# Altium schematic sheet LEDs_Switches.SchDoc: LEDs AND SWITCHES
size A4; DocumentNumber: 12; SheetNumber: 12; SheetTotal: 18
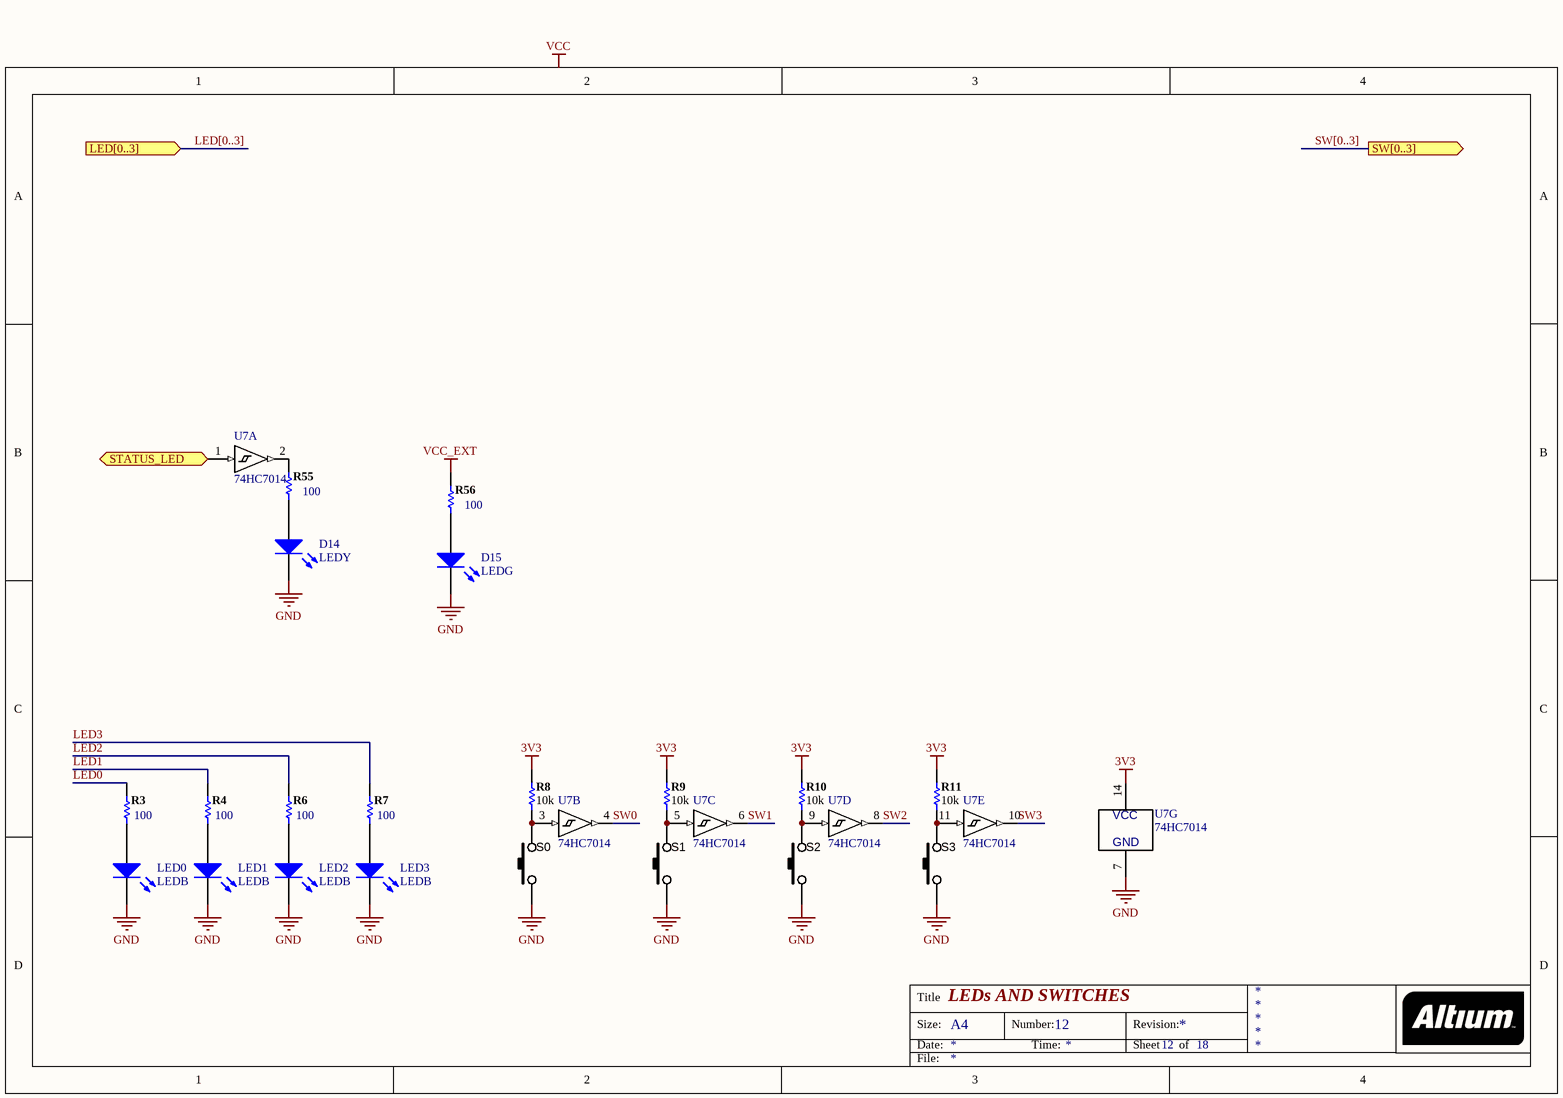
[diagram p0: LEDs_Switches.SchDoc]

## Parts
D14  LEDY  [LED-0805-K]
D15  LEDG  [LED-0805-K]
LED0  LEDB  [LED-0805-K]
LED1  LEDB  [LED-0805-K]
LED2  LEDB  [LED-0805-K]
LED3  LEDB  [LED-0805-K]
R3  100  [0805R-100]
R4  100  [0805R-100]
R6  100  [0805R-100]
R7  100  [0805R-100]
R8  10k  [0805R-10K]
R9  10k  [0805R-10K]
R10  10k  [0805R-10K]
R11  10k  [0805R-10K]
R55  100  [0805R-100]
R56  100  [0805R-100]
S0  EVQ-PQHB55  [TACT-SWITCH-TS1150]  (value not drawn)
S1  EVQ-PQHB55  [TACT-SWITCH-TS1150]  (value not drawn)
S2  EVQ-PQHB55  [TACT-SWITCH-TS1150]  (value not drawn)
S3  EVQ-PQHB55  [TACT-SWITCH-TS1150]  (value not drawn)
U7  74HC7014  [SO14]  (parts A,B,C,D,E,G of 7)

## Ports
LED[0..3] (in), STATUS_LED (in), SW[0..3] (out)

## Nets
3V3: R8.2 R9.2 R10.2 R11.2 U7.14(VCC)
GND: D14.K D15.K LED0.K LED1.K LED2.K LED3.K S0.1 S1.1 S2.1 S3.1 U7.7(GND)
VCC_EXT: R56.2
LED0: R3.2
LED1: R4.2
LED2: R6.2
LED3: R7.2
STATUS_LED: U7.1(A) ; port STATUS_LED
SW0: U7.4(Y)
SW1: U7.6(Y)
SW2: U7.8(Y)
SW3: U7.10(Y)
NetD14_A: D14.A R55.1
NetD15_A: D15.A R56.1
NetLED0_A: LED0.A R3.1
NetLED1_A: LED1.A R4.1
NetLED2_A: LED2.A R6.1
NetLED3_A: LED3.A R7.1
NetR8_1: R8.1 S0.2 U7.3(A)
NetR9_1: R9.1 S1.2 U7.5(A)
NetR10_1: R10.1 S2.2 U7.9(A)
NetR11_1: R11.1 S3.2 U7.11(A)
NetR55_2: R55.2 U7.2(Y)

## Buses and harness runs
bus LED[0..3] = port LED[0..3]
bus SW[0..3] = port SW[0..3]

## Notes on the sheet
- Labels drawn without touching a wire or pin: VCC
- Title
- Size:
- Date:
- A4
- Number:
- Time:
- Revision:
- Sheet
- of
- File:

## Library data of the parts
D14 D15 = LED2: Typical RED, GREEN, YELLOW, AMBER GaAs LED; Published: 8-Jun-2000; LatestRevisionDate: 17-Jul-2002; LatestRevisionNote: Re-released for DXP Platform.; PackageVersion: Feb-2002; PackageReference: 3.2X1.6X1.1; Publisher: Altium Limited; PackageDescription: SM LED; 2 Flat Leads
LED0-LED3 = LED2: Typical BLUE GaAs LED; Published: 8-Jun-2000; LatestRevisionDate: 17-Jul-2002; LatestRevisionNote: Re-released for DXP Platform.; PackageVersion: Feb-2002; PackageReference: 3.2X1.6X1.1; Publisher: Altium Limited; PackageDescription: SM LED; 2 Flat Leads
R3 R4 R6-R11 R55 R56 = D-100-0116: Tolerance: 1 %; Mounting Technology: Surface Mount; Status: Production; Category: Resistor
  R3 R4 R6 R7 R55 R56: Value: 100
  R8-R11: Value: 10k
S0-S3 = SW_EVQ-PQHB55: Low-profile captive tact switch; Manufacturer 1: Panasonic - ECG; Ratings: 1.6 Newton; Switch Function: Off-Mom; Contact Rating @ Voltage: 0.02A @ 15VDC; Outline: 4.50mm x 4.50mm; Operating Force: 160gf; SCDType: spec; Function: On/Off; Package / Case: per dwg; Supplier 1: Digi-Key; Supplier Part Number 1: P8090SCT-ND; Mounting Type: Surface Mount; Orientation: Vertical; ComponentLink1URL: http://industrial.panasonic.com/www-data/pdf/ATK0000/ATK0000CE1.pdf; ComponentLink1Description: http://industrial.panasonic.com/www-data/pdf/ATK0000/ATK0000CE1.pdf; Manufacturer Part Number 1: EVQ-PQHB55
U7 = 74HC7014: IC, Hex Schmitttrigger Buffer, SO-14